# EAGLE design schematics (EAGLE 9.4.2)
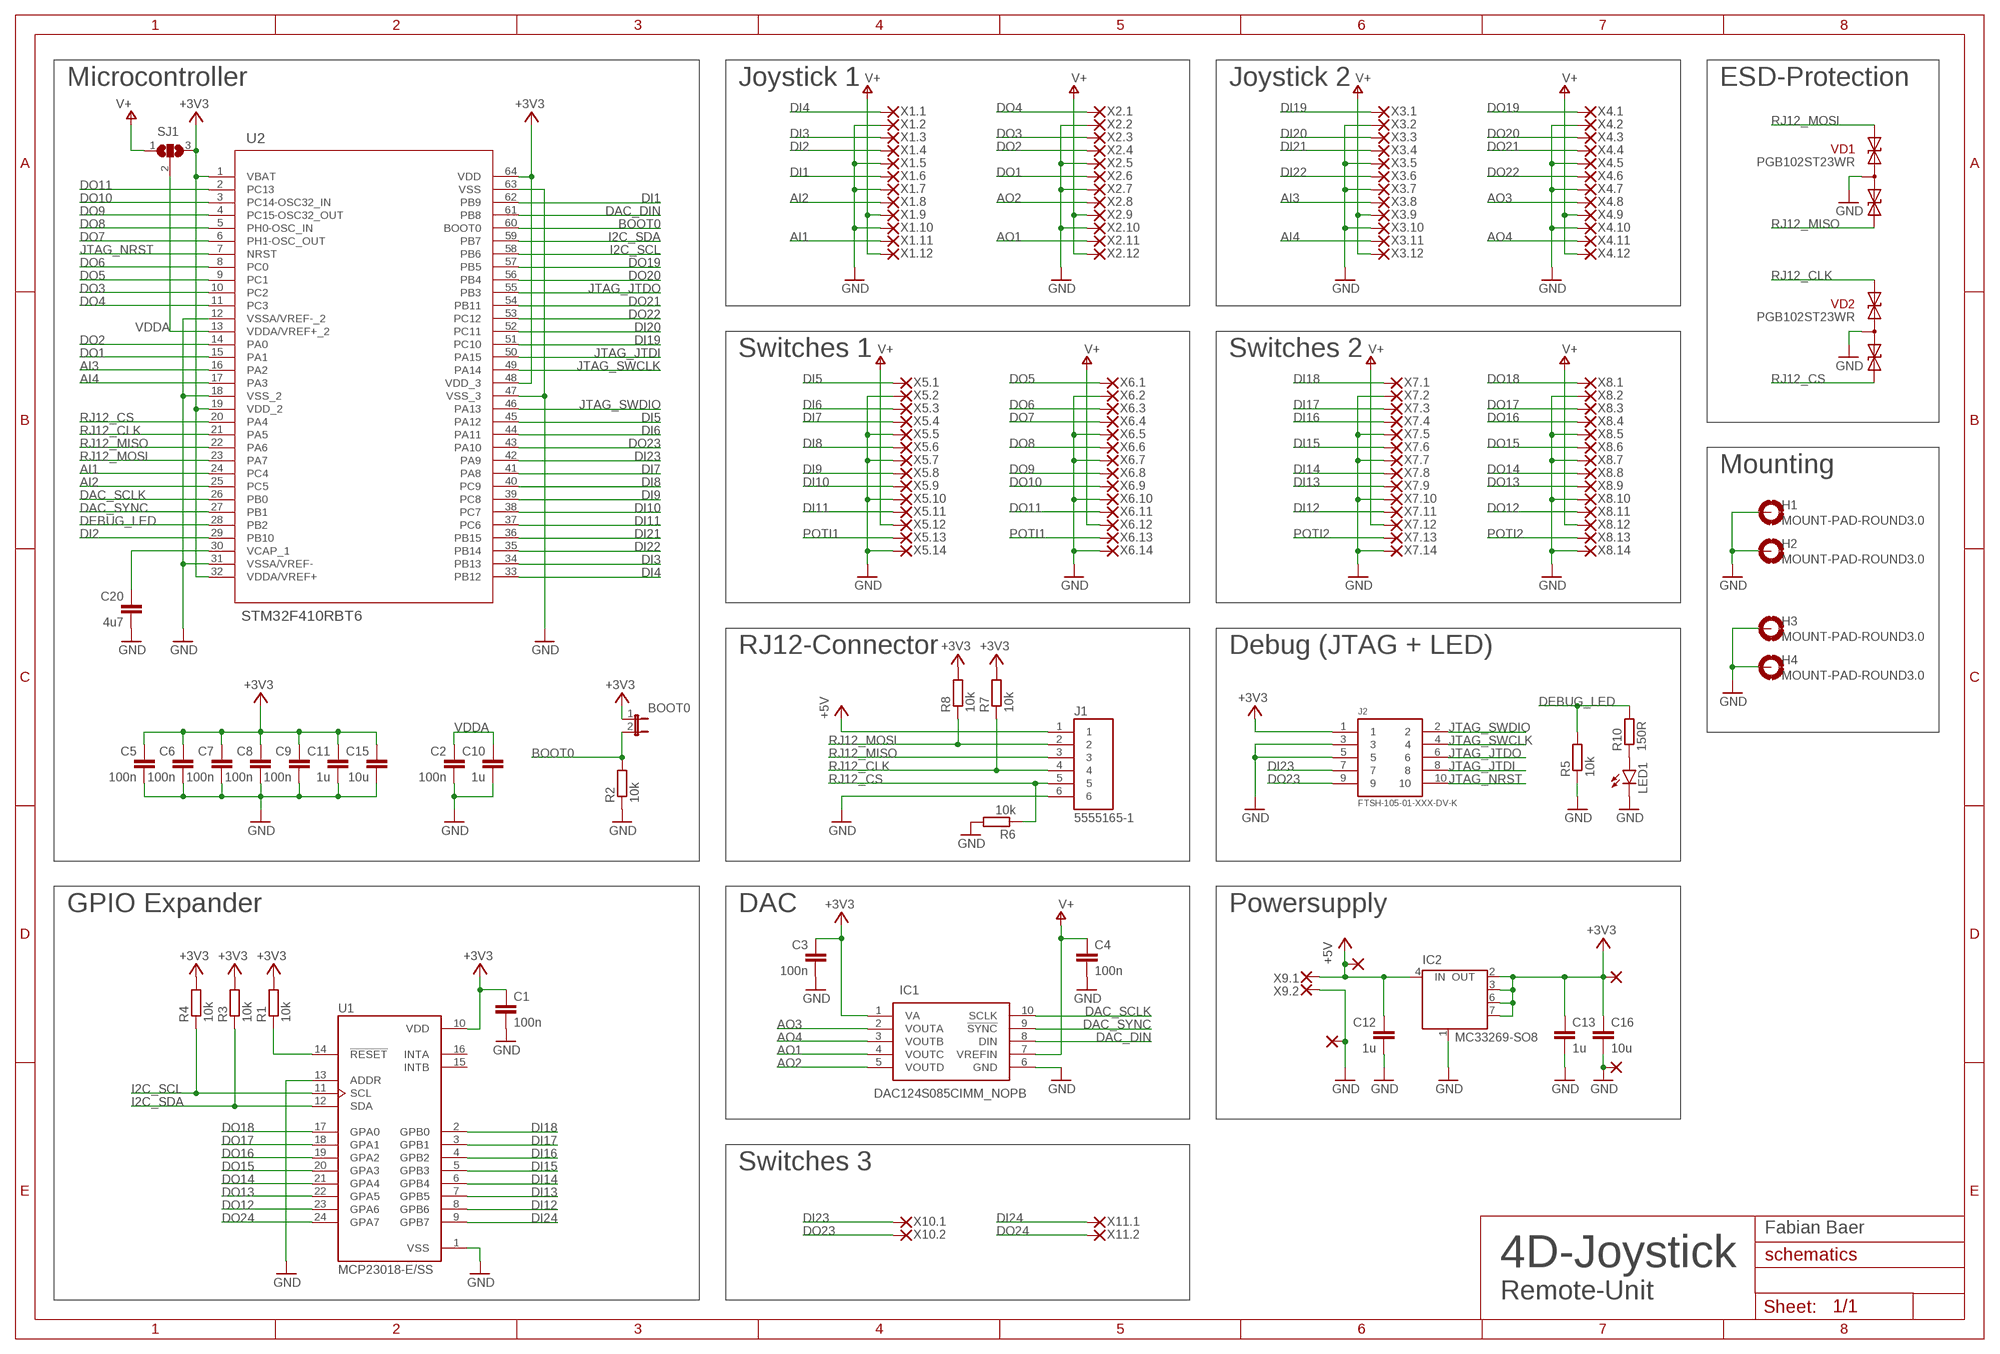
[diagram p0: schematic, sheet 1]

## Parts
BOOT0  JP1E  [JP1]
C1  100n  C-EUC0603  [C0603]
C2  100n  C-EUC0603  [C0603]
C3  100n  C-EUC0603  [C0603]
C4  100n  C-EUC0603  [C0603]
C5  100n  C-EUC0603  [C0603]
C6  100n  C-EUC0603  [C0603]
C7  100n  C-EUC0603  [C0603]
C8  100n  C-EUC0603  [C0603]
C9  100n  C-EUC0603  [C0603]
C10  1u  C-EUC0603  [C0603]
C11  1u  C-EUC0603  [C0603]
C12  1u  C-EUC0603  [C0603]
C13  1u  C-EUC0603  [C0603]
C15  10u  C-EUC0603  [C0603]
C16  10u  C-EUC0603  [C0603]
C20  4u7  C-EUC0603  [C0603]
H1  MOUNT-PAD-ROUND3.0  [3,0-PAD]
H2  MOUNT-PAD-ROUND3.0  [3,0-PAD]
H3  MOUNT-PAD-ROUND3.0  [3,0-PAD]
H4  MOUNT-PAD-ROUND3.0  [3,0-PAD]
IC1  DAC124S085CIMM_NOPB  [SOP50P490X110-10N]
IC2  MC33269-SO8  [SO08]
J1  5555165-1  [TE_5555165-1]
J2  FTSH-105-01-XXX-DV-K  [FTSH-105-01-XXX-DV-K]
LED1  LEDSML0603  [SML0603]
R1  10k  R-EU_R0603  [R0603]
R2  10k  R-EU_R0603  [R0603]
R3  10k  R-EU_R0603  [R0603]
R4  10k  R-EU_R0603  [R0603]
R5  10k  R-EU_R0603  [R0603]
R6  10k  R-EU_R0603  [R0603]
R7  10k  R-EU_R0603  [R0603]
R8  10k  R-EU_R0603  [R0603]
R10  150R  R-EU_R0603  [R0603]
SJ1  SJ2W  [SJ_2]
U1  MCP23018-E/SS  [SOP65P780X200-24N]
U2  STM32F410RBT6  [LQFP64-10X10MM]
VD1  PGB102ST23WR  [SOT23]
VD2  PGB102ST23WR  [SOT23]
X1.1  WIREPAD1,6/0,9  [1,6/0,9]
X1.2  WIREPAD1,6/0,9  [1,6/0,9]
X1.3  WIREPAD1,6/0,9  [1,6/0,9]
X1.4  WIREPAD1,6/0,9  [1,6/0,9]
X1.5  WIREPAD1,6/0,9  [1,6/0,9]
X1.6  WIREPAD1,6/0,9  [1,6/0,9]
X1.7  WIREPAD1,6/0,9  [1,6/0,9]
X1.8  WIREPAD1,6/0,9  [1,6/0,9]
X1.9  WIREPAD1,6/0,9  [1,6/0,9]
X1.10  WIREPAD1,6/0,9  [1,6/0,9]
X1.11  WIREPAD1,6/0,9  [1,6/0,9]
X1.12  WIREPAD1,6/0,9  [1,6/0,9]
X2.1  WIREPAD1,6/0,9  [1,6/0,9]
X2.2  WIREPAD1,6/0,9  [1,6/0,9]
X2.3  WIREPAD1,6/0,9  [1,6/0,9]
X2.4  WIREPAD1,6/0,9  [1,6/0,9]
X2.5  WIREPAD1,6/0,9  [1,6/0,9]
X2.6  WIREPAD1,6/0,9  [1,6/0,9]
X2.7  WIREPAD1,6/0,9  [1,6/0,9]
X2.8  WIREPAD1,6/0,9  [1,6/0,9]
X2.9  WIREPAD1,6/0,9  [1,6/0,9]
X2.10  WIREPAD1,6/0,9  [1,6/0,9]
X2.11  WIREPAD1,6/0,9  [1,6/0,9]
X2.12  WIREPAD1,6/0,9  [1,6/0,9]
X3.1  WIREPAD1,6/0,9  [1,6/0,9]
X3.2  WIREPAD1,6/0,9  [1,6/0,9]
X3.3  WIREPAD1,6/0,9  [1,6/0,9]
X3.4  WIREPAD1,6/0,9  [1,6/0,9]
X3.5  WIREPAD1,6/0,9  [1,6/0,9]
X3.6  WIREPAD1,6/0,9  [1,6/0,9]
X3.7  WIREPAD1,6/0,9  [1,6/0,9]
X3.8  WIREPAD1,6/0,9  [1,6/0,9]
X3.9  WIREPAD1,6/0,9  [1,6/0,9]
X3.10  WIREPAD1,6/0,9  [1,6/0,9]
X3.11  WIREPAD1,6/0,9  [1,6/0,9]
X3.12  WIREPAD1,6/0,9  [1,6/0,9]
X4.1  WIREPAD1,6/0,9  [1,6/0,9]
X4.2  WIREPAD1,6/0,9  [1,6/0,9]
X4.3  WIREPAD1,6/0,9  [1,6/0,9]
X4.4  WIREPAD1,6/0,9  [1,6/0,9]
X4.5  WIREPAD1,6/0,9  [1,6/0,9]
X4.6  WIREPAD1,6/0,9  [1,6/0,9]
X4.7  WIREPAD1,6/0,9  [1,6/0,9]
X4.8  WIREPAD1,6/0,9  [1,6/0,9]
X4.9  WIREPAD1,6/0,9  [1,6/0,9]
X4.10  WIREPAD1,6/0,9  [1,6/0,9]
X4.11  WIREPAD1,6/0,9  [1,6/0,9]
X4.12  WIREPAD1,6/0,9  [1,6/0,9]
X5.1  WIREPAD1,6/0,9  [1,6/0,9]
X5.2  WIREPAD1,6/0,9  [1,6/0,9]
X5.3  WIREPAD1,6/0,9  [1,6/0,9]
X5.4  WIREPAD1,6/0,9  [1,6/0,9]
X5.5  WIREPAD1,6/0,9  [1,6/0,9]
X5.6  WIREPAD1,6/0,9  [1,6/0,9]
X5.7  WIREPAD1,6/0,9  [1,6/0,9]
X5.8  WIREPAD1,6/0,9  [1,6/0,9]
X5.9  WIREPAD1,6/0,9  [1,6/0,9]
X5.10  WIREPAD1,6/0,9  [1,6/0,9]
X5.11  WIREPAD1,6/0,9  [1,6/0,9]
X5.12  WIREPAD1,6/0,9  [1,6/0,9]
X5.13  WIREPAD1,6/0,9  [1,6/0,9]
X5.14  WIREPAD1,6/0,9  [1,6/0,9]
X5.15  WIREPAD1,6/0,9  [1,6/0,9]
X5.16  WIREPAD1,6/0,9  [1,6/0,9]
X5.17  WIREPAD1,6/0,9  [1,6/0,9]
X5.18  WIREPAD1,6/0,9  [1,6/0,9]
X6.1  WIREPAD1,6/0,9  [1,6/0,9]
X6.2  WIREPAD1,6/0,9  [1,6/0,9]
X6.3  WIREPAD1,6/0,9  [1,6/0,9]
X6.4  WIREPAD1,6/0,9  [1,6/0,9]
X6.5  WIREPAD1,6/0,9  [1,6/0,9]
X6.6  WIREPAD1,6/0,9  [1,6/0,9]
X6.7  WIREPAD1,6/0,9  [1,6/0,9]
X6.8  WIREPAD1,6/0,9  [1,6/0,9]
X6.9  WIREPAD1,6/0,9  [1,6/0,9]
X6.10  WIREPAD1,6/0,9  [1,6/0,9]
X6.11  WIREPAD1,6/0,9  [1,6/0,9]
X6.12  WIREPAD1,6/0,9  [1,6/0,9]
X6.13  WIREPAD1,6/0,9  [1,6/0,9]
X6.14  WIREPAD1,6/0,9  [1,6/0,9]
X7.1  WIREPAD1,6/0,9  [1,6/0,9]
X7.2  WIREPAD1,6/0,9  [1,6/0,9]
X7.3  WIREPAD1,6/0,9  [1,6/0,9]
X7.4  WIREPAD1,6/0,9  [1,6/0,9]
X7.5  WIREPAD1,6/0,9  [1,6/0,9]
X7.6  WIREPAD1,6/0,9  [1,6/0,9]
X7.7  WIREPAD1,6/0,9  [1,6/0,9]
X7.8  WIREPAD1,6/0,9  [1,6/0,9]
X7.9  WIREPAD1,6/0,9  [1,6/0,9]
X7.10  WIREPAD1,6/0,9  [1,6/0,9]
X7.11  WIREPAD1,6/0,9  [1,6/0,9]
X7.12  WIREPAD1,6/0,9  [1,6/0,9]
X7.13  WIREPAD1,6/0,9  [1,6/0,9]
X7.14  WIREPAD1,6/0,9  [1,6/0,9]
X8.1  WIREPAD1,6/0,9  [1,6/0,9]
X8.2  WIREPAD1,6/0,9  [1,6/0,9]
X8.3  WIREPAD1,6/0,9  [1,6/0,9]
X8.4  WIREPAD1,6/0,9  [1,6/0,9]
X8.5  WIREPAD1,6/0,9  [1,6/0,9]
X8.6  WIREPAD1,6/0,9  [1,6/0,9]
X8.7  WIREPAD1,6/0,9  [1,6/0,9]
X8.8  WIREPAD1,6/0,9  [1,6/0,9]
X8.9  WIREPAD1,6/0,9  [1,6/0,9]
X8.10  WIREPAD1,6/0,9  [1,6/0,9]
X8.11  WIREPAD1,6/0,9  [1,6/0,9]
X8.12  WIREPAD1,6/0,9  [1,6/0,9]
X8.13  WIREPAD1,6/0,9  [1,6/0,9]
X8.14  WIREPAD1,6/0,9  [1,6/0,9]
X9.1  WIREPAD2,54/1,0  [2,54/1,0]
X9.2  WIREPAD2,54/1,0  [2,54/1,0]
X10.1  WIREPAD1,6/0,9  [1,6/0,9]
X10.2  WIREPAD1,6/0,9  [1,6/0,9]
X11.1  WIREPAD1,6/0,9  [1,6/0,9]
X11.2  WIREPAD1,6/0,9  [1,6/0,9]

## Nets
+3V3: BOOT0.1 C1.1 C3.1 C5.1 C6.1 C7.1 C8.1 C9.1 C11.1 C13.1 C15.1 C16.1 IC1.1(VA) IC2.2(OUT) IC2.3(OUT) IC2.6(OUT) IC2.7(OUT) J2.1 R1.2 R3.2 R4.2 R7.2 R8.2 SJ1.3 U1.10(VDD) U2.1(VBAT) U2.19(VDD_2) U2.32(VDDA/VREF+) U2.48(VDD_3) U2.64(VDD) X5.15.1(P)
+5V: C12.1 IC2.4(IN) J1.1 X5.17.1(P) X9.1.1(P)
AI1: U2.24(PC4) X1.11.1(P)
AI2: U2.25(PC5) X1.8.1(P)
AI3: U2.16(PA2) X3.8.1(P)
AI4: U2.17(PA3) X3.11.1(P)
AO1: IC1.4(VOUTC) X2.11.1(P)
AO2: IC1.5(VOUTD) X2.8.1(P)
AO3: IC1.2(VOUTA) X4.8.1(P)
AO4: IC1.3(VOUTB) X4.11.1(P)
BOOT0: BOOT0.2 R2.2 U2.60(BOOT0)
DAC_DIN: IC1.8(DIN) U2.61(PB8)
DAC_SCLK: IC1.10(SCLK) U2.26(PB0)
DAC_SYNC: IC1.9(!SYNC) U2.27(PB1)
DEBUG_LED: R5.2 R10.2 U2.28(PB2)
DI1: U2.62(PB9) X1.6.1(P)
DI2: U2.29(PB10) X1.4.1(P)
DI3: U2.34(PB13) X1.3.1(P)
DI4: U2.33(PB12) X1.1.1(P)
DI5: U2.45(PA12) X5.1.1(P)
DI6: U2.44(PA11) X5.3.1(P)
DI7: U2.41(PA8) X5.4.1(P)
DI8: U2.40(PC9) X5.6.1(P)
DI9: U2.39(PC8) X5.8.1(P)
DI10: U2.38(PC7) X5.9.1(P)
DI11: U2.37(PC6) X5.11.1(P)
DI12: U1.8(GPB6) X7.11.1(P)
DI13: U1.7(GPB5) X7.9.1(P)
DI14: U1.6(GPB4) X7.8.1(P)
DI15: U1.5(GPB3) X7.6.1(P)
DI16: U1.4(GPB2) X7.4.1(P)
DI17: U1.3(GPB1) X7.3.1(P)
DI18: U1.2(GPB0) X7.1.1(P)
DI19: U2.51(PC10) X3.1.1(P)
DI20: U2.52(PC11) X3.3.1(P)
DI21: U2.36(PB15) X3.4.1(P)
DI22: U2.35(PB14) X3.6.1(P)
DI23: J2.7 U2.42(PA9) X10.1.1(P)
DI24: U1.9(GPB7) X11.1.1(P)
DO1: U2.15(PA1) X2.6.1(P)
DO2: U2.14(PA0) X2.4.1(P)
DO3: U2.10(PC2) X2.3.1(P)
DO4: U2.11(PC3) X2.1.1(P)
DO5: U2.9(PC1) X6.1.1(P)
DO6: U2.8(PC0) X6.3.1(P)
DO7: U2.6(PH1-OSC_OUT) X6.4.1(P)
DO8: U2.5(PH0-OSC_IN) X6.6.1(P)
DO9: U2.4(PC15-OSC32_OUT) X6.8.1(P)
DO10: U2.3(PC14-OSC32_IN) X6.9.1(P)
DO11: U2.2(PC13) X6.11.1(P)
DO12: U1.23(GPA6) X8.11.1(P)
DO13: U1.22(GPA5) X8.9.1(P)
DO14: U1.21(GPA4) X8.8.1(P)
DO15: U1.20(GPA3) X8.6.1(P)
DO16: U1.19(GPA2) X8.4.1(P)
DO17: U1.18(GPA1) X8.3.1(P)
DO18: U1.17(GPA0) X8.1.1(P)
DO19: U2.57(PB5) X4.1.1(P)
DO20: U2.56(PB4) X4.3.1(P)
DO21: U2.54(PB11) X4.4.1(P)
DO22: U2.53(PC12) X4.6.1(P)
DO23: J2.9 U2.43(PA10) X10.2.1(P)
DO24: U1.24(GPA7) X11.2.1(P)
GND: C1.2 C2.2 C3.2 C4.2 C5.2 C6.2 C7.2 C8.2 C9.2 C10.2 C11.2 C12.2 C13.2 C15.2 C16.2 C20.2 H1.B3,0(MOUNT) H2.B3,0(MOUNT) H3.B3,0(MOUNT) H4.B3,0(MOUNT) IC1.6(GND) IC2.1(GND/ADJ) J1.6 J2.3 J2.5 LED1.C R2.1 R5.1 R6.2 U1.1(VSS) U1.13(ADDR) U2.12(VSSA/VREF-_2) U2.18(VSS_2) U2.31(VSSA/VREF-) U2.47(VSS_3) U2.63(VSS) VD1.3(C) VD2.3(C) X1.2.1(P) X1.5.1(P) X1.7.1(P) X1.10.1(P) X2.2.1(P) X2.5.1(P) X2.7.1(P) X2.10.1(P) X3.2.1(P) X3.5.1(P) X3.7.1(P) X3.10.1(P) X4.2.1(P) X4.5.1(P) X4.7.1(P) X4.10.1(P) X5.2.1(P) X5.5.1(P) X5.7.1(P) X5.10.1(P) X5.14.1(P) X5.16.1(P) X5.18.1(P) X6.2.1(P) X6.5.1(P) X6.7.1(P) X6.10.1(P) X6.14.1(P) X7.2.1(P) X7.5.1(P) X7.7.1(P) X7.10.1(P) X7.14.1(P) X8.2.1(P) X8.5.1(P) X8.7.1(P) X8.10.1(P) X8.14.1(P) X9.2.1(P)
I2C_SCL: R4.1 U1.11(SCL) U2.58(PB6)
I2C_SDA: R3.1 U1.12(SDA) U2.59(PB7)
JTAG_JTDI: J2.8 U2.50(PA15)
JTAG_JTDO: J2.6 U2.55(PB3)
JTAG_NRST: J2.10 U2.7(NRST)
JTAG_SWCLK: J2.4 U2.49(PA14)
JTAG_SWDIO: J2.2 U2.46(PA13)
N$1: R1.1 U1.14(!RESET)
N$2: C20.1 U2.30(VCAP_1)
N$5: LED1.A R10.1
POTI1: X5.13.1(P) X6.13.1(P)
POTI2: X7.13.1(P) X8.13.1(P)
RJ12_CLK: J1.4 R7.1 U2.21(PA5) VD2.2(A1)
RJ12_CS: J1.5 R6.1 U2.20(PA4) VD2.1(A)
RJ12_MISO: J1.3 U2.22(PA6) VD1.1(A)
RJ12_MOSI: J1.2 R8.1 U2.23(PA7) VD1.2(A1)
V+: C4.1 IC1.7(VREFIN) SJ1.1 X1.9.1(P) X1.12.1(P) X2.9.1(P) X2.12.1(P) X3.9.1(P) X3.12.1(P) X4.9.1(P) X4.12.1(P) X5.12.1(P) X6.12.1(P) X7.12.1(P) X8.12.1(P)
VDDA: C2.1 C10.1 SJ1.2 U2.13(VDDA/VREF+_2)
Unconnected: U1.15(INTB) U1.16(INTA)

## Notes on the sheet
- Microcontroller | Joystick 1 | Joystick 2 | ESD-Protection
- Switches 1 | Switches 2
- Mounting
- RJ12-Connector | Debug (JTAG + LED)
- GPIO Expander | DAC | Powersupply
- Switches 3
- Fabian Baer
- 4D-Joystick
- Remote-Unit

## Library data of the parts
BOOT0 = jumper:JP1E: JUMPER
C1-C13 C15 C16 C20 = rcl:C-EU: CAPACITOR, European symbol; SPICEPREFIX: C
H1-H4 = holes:MOUNT-PAD-ROUND: MOUNTING PAD, round
IC1 = DAC124S085CIMM_NOPB:DAC124S085CIMM_NOPB: 12-Bit Micro Power QUAD Digital-to-Analog Converter with Rail-to-Rail Output Source: Datasheet <http://www.ti.com/lit/gpn/dac124s085>; DESCRIPTION: 12-Bit Micro Power QUAD Digital-to-Analog Converter with Rail-to-Rail Output; HEIGHT: 1.1mm; MANUFACTURER_NAME: Texas Instruments; MANUFACTURER_PART_NUMBER: DAC124S085CIMM/NOPB; MOUSER_PART_NUMBER: 926-DAC124S085CIMMNO; MOUSER_PRICE-STOCK: https://www.mouser.com/Search/Refine.aspx?Keyword=926-DAC124S085CIMMNO; RS_PART_NUMBER: 6512026P; RS_PRICE-STOCK: http://uk.rs-online.com/web/p/products/6512026P
IC2 = linear:MC33269-SO8: Adjustable Output Low Dropout Voltage Regulator 800 mA Source: http://www.onsemi.com/pub/Collateral/MC33269-D.PDF
J1 = 5555165-1:5555165-1: CONN MOD JACK 6P6C R/A UNSHLD; AVAILABILITY: Unavailable; CENTERLINE_PITCH: 1.02 mm[.04 in]; COMMENT: 5555165-1; DESCRIPTION: Conn RJ-25 F 6 POS 2.54mm Solder RA Thru-Hole 6 Terminal 1 Port Cat 3 Box/Package/Tray; EU_ROHS_COMPLIANCE: Compliant; MF: TE Connectivity; MP: 5555165-1; NUMBER_OF_POSITIONS: 6; PACKAGE: None; PRICE: None; TE_PURCHASE_URL: https://www.te.com/usa-en/product-5555165-1.html?te_bu=Cor&te_type=disp&te_campaign=seda_glo_cor-seda-global-disp-prtnr-fy19-seda-model-bom-cta_sma-317_1&elqCampaignId=32493
J2 = FTSH-105-01-XXX-DV-K:FTSH-105-01-XXX-DV-K: 0.05"x0.05" DOUBLE ROW SMT STRIP ASSEMBLY. MANUFACTURER:SAMTEC.
LED1 = led:LED: LED OSRAM: - CHIPLED LG R971, LG N971, LY N971, LG Q971, LY Q971, LO R971, LY R971 LH N974, LH R974 LS Q976, LO Q976, LY Q976 LO Q996 - Hyper CHIPLED LW Q18S LB Q993, LB Q99A, LB R99A - SideLED LS A670, LO A670, LY A670, LG A670, LP A670 LB A673, LV A673, LT A673, LW A673 LH A674 LY A675 LS A676, LA A676, LO A676, LY A676, LW A676 LS A679, LY A679, LG A679 - Hyper Micro SIDELED® LS Y876, LA Y876, LO Y876, LY Y876 LT Y87S - SmartLED LW L88C, LW L88S LB L89C, LB L89S, LG L890 LS L89K, LO L89K, LY L89K LS L896, LA L896, LO L896, LY L896 - TOPLED LS T670, LO T670, LY T670, LG T670, LP T670 LSG T670, LSP T670, LSY T670, LOP T670, LYG T670 LG T671, LOG T671, LSG T671 LB T673, LV T673, LT T673, LW T673 LH T674 LS T676, LA T676, LO T676, LY T676, LB T676, LH T676, LSB T676, LW T676 LB T67C, LV T67C, LT T67C, LS T67K, LO T67K, LY T67K, LW E67C LS E67B, LA E67B, LO E67B, LY E67B, LB E67C, LV E67C, LT E67C LW T67C LS T679, LY T679, LG T679 LS T770, LO T770, LY T770, LG T770, LP T770 LB T773, LV T773, LT T773, LW T773 LH T774 LS E675, LA E675, LY E675, LS T675 LS T776, LA T776, LO T776, LY T776, LB T776 LHGB T686 LT T68C, LB T68C - Hyper Mini TOPLED® LB M676 - Mini TOPLED Santana® LG M470 LS M47K, LO M47K, LY M47K Source: http://www.osram.convergy.de LUXEON: - LUMILED® LXK2-PW12-R00, LXK2-PW12-S00, LXK2-PW14-U00, LXK2-PW14-V00 LXK2-PM12-R00, LXK2-PM12-S00, LXK2-PM14-U00 LXK2-PE12-Q00, LXK2-PE12-R00, LXK2-PE12-S00, LXK2-PE14-T00, LXK2-PE14-U00 LXK2-PB12-K00, LXK2-PB12-L00, LXK2-PB12-M00, LXK2-PB14-N00, LXK2-PB14-P00, LXK2-PB14-Q00 LXK2-PR12-L00, LXK2-PR12-M00, LXK2-PR14-Q00, LXK2-PR14-R00 LXK2-PD12-Q00, LXK2-PD12-R00, LXK2-PD12-S00 LXK2-PH12-R00, LXK2-PH12-S00 LXK2-PL12-P00, LXK2-PL12-Q00, LXK2-PL12-R00 Source: www.luxeon.com KINGBRIGHT: KA-3528ASYC Source: www.kingbright.com
R1-R8 R10 = rcl:R-EU_: RESISTOR, European symbol; SPICEPREFIX: R
SJ1 = jumper:SJ2W: SMD solder JUMPER
U1 = MCP23018-E_SS:MCP23018-E/SS: IC: expander; 16bit I/O port; I2C; SSOP24; 1.8÷5.5VDC; AVAILABILITY: Unavailable; DESCRIPTION: IC: expander; 16bit I/O port; I2C; SSOP24; 1.8÷5.5VDC; MF: Microchip; MP: MCP23018-E/SS; PACKAGE: SSOP-24 Microchip; PRICE: None
U2 = stm32f10:STM32F410RBT6; MANUFACTURER_PART_NUMBER: stm32f410r3; VENDOR: STMicroelectronics
VD1 VD2 = diodes-zener:PGB102ST23WR; MOUSER: 576-PGB102ST23WR
X1.1-X1.12 X2.1-X2.12 X3.1-X3.12 X4.1-X4.12 X5.1-X5.18 X6.1-X6.14 X7.1-X7.14 X8.1-X8.14 X9.1 X9.2 X10.1 X10.2 X11.1 X11.2 = wirepad:WIREPAD: Wire PAD connect wire on PCB

## Board
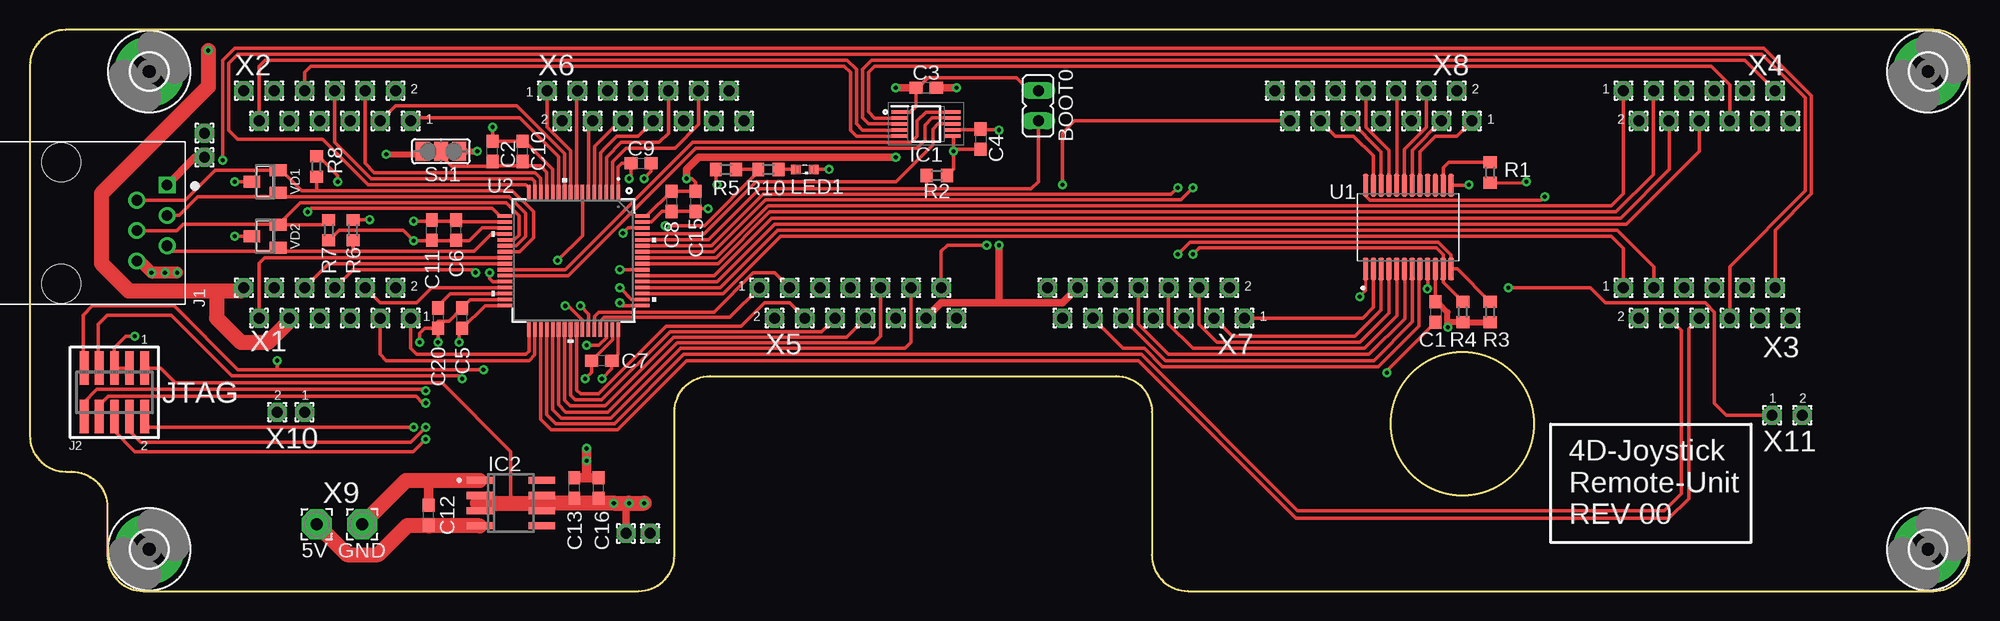
[diagram p1: board, top side]
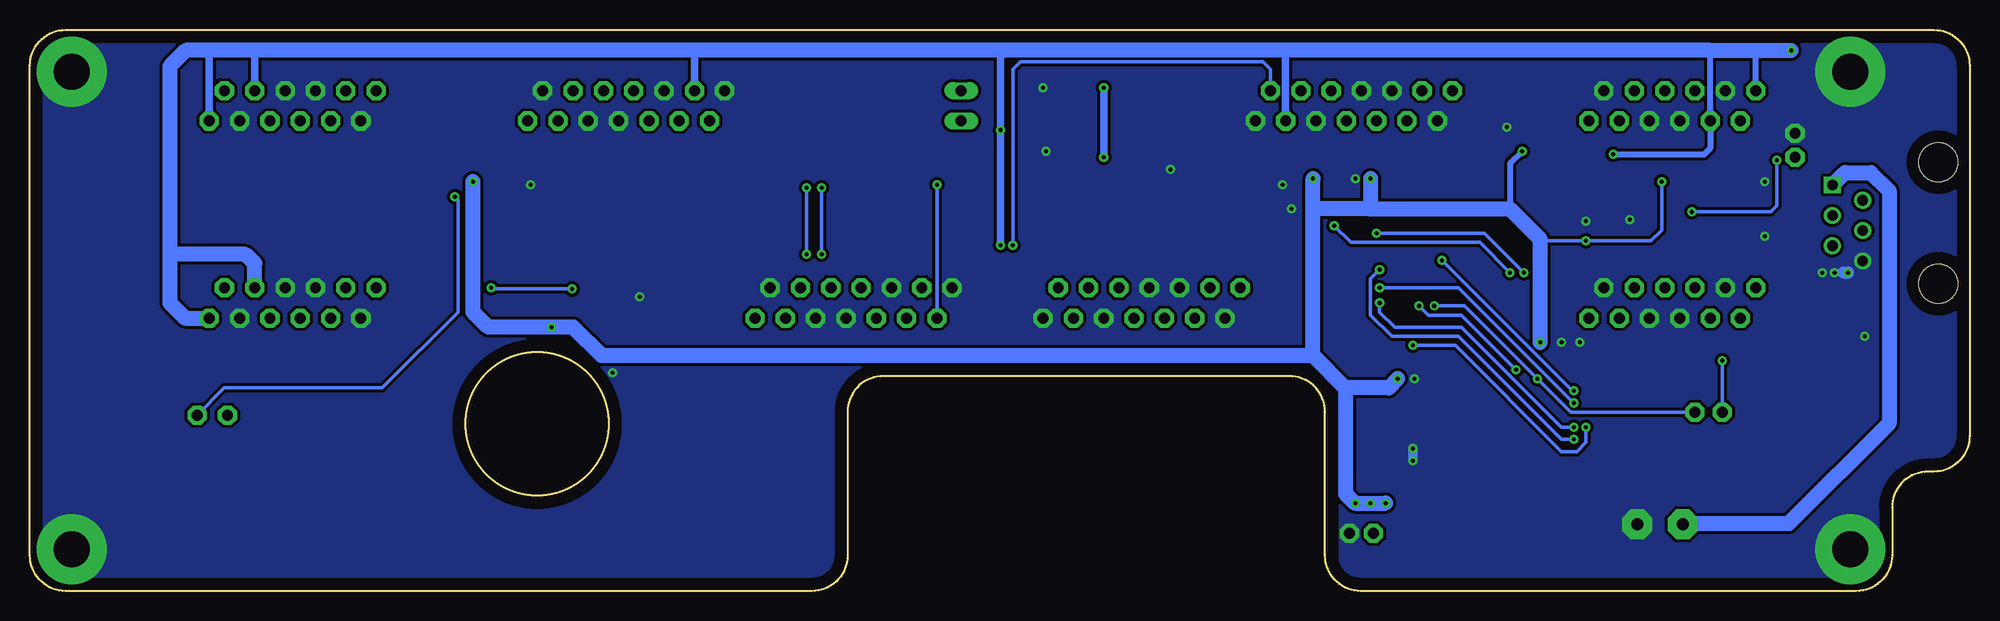
[diagram p2: board, bottom side, seen from below]

Size 162.5 x 47 mm. Coordinates in mm from the lower left corner, seen from the top.
Outline: 6.5,3 arc90 9.5,0 51,0 arc90 54,3 54,15 arc-90 57,18 91,18 arc-90 94,15 94,3 arc90 97,0 159.5,0 arc90 162.5,3 162.5,44 arc90 159.5,47 3,47 arc90 0,44 0,13 arc90 3,10 3.5,10 arc-90 6.5,7 6.5,3
Outline: circle at 120,14 radius 6
Copper layers (1*16): Top 0.035mm / dielectric 1.5mm / Bottom 0.035mm
Design rules "default *": minimum track width 6mil, minimum drill 0.35mm, track to track 6mil, track to pad 6mil, pad to pad 6mil, via to via 6mil, smd to smd 6mil, copper to edge 40mil, drill to drill 6mil, minimum pad ring 10mil, minimum via ring 8mil, stop-mask expansion 2mil, vias tented up to drill 0mil, thermal gap 10mil

### Footprints (pad centres in the part's own frame; a part is rotated, then mirrored left to right if it is on the bottom)
JP1 = drill 0.914 long: 1 0,-1.27; 2 0,1.27
C0603 = smd 1.1 x 1: 1 -0.85,0; 2 0.85,0
3,0-PAD = drill 3 pad 5.842: B3,0 0,0
SOP50P490X110-10N = smd 1.4 x 0.3: 1 -2.2,1; 2 -2.2,0.5; 3 -2.2,0; 4 -2.2,-0.5; 5 -2.2,-1; 6 2.2,-1; 7 2.2,-0.5; 8 2.2,0; 9 2.2,0.5; 10 2.2,1
SO08 = smd 0.6 x 2.2: 1 -1.905,-2.6; 2 -0.635,-2.6; 3 0.635,-2.6; 4 1.905,-2.6; 5 1.905,2.6; 6 0.635,2.6; 7 -0.635,2.6; 8 -1.905,2.6
TE_5555165-1 = drill 0.89 square: 1 0,0 | drill 0.89: 2 1.27,-2.54; 3 2.54,0; 4 3.81,-2.54; 5 5.08,0; 6 6.35,-2.54 | hole 3.25: -1.91,-8.89; 8.25,-8.89
FTSH-105-01-XXX-DV-K = smd 0.737 x 2.794: 1 -2.54,-2.032; 2 -2.54,2.032; 3 -1.27,-2.032; 4 -1.27,2.032; 5 0,-2.032; 6 0,2.032; 7 1.27,-2.032; 8 1.27,2.032; 9 2.54,-2.032; 10 2.54,2.032
SML0603 = smd 0.8 x 0.8: A 0.75,0; C -0.75,0
R0603 = smd 1 x 1.1: 1 -0.85,0; 2 0.85,0
SJ_2 = smd 1.168 x 1.6: 1 -1.524,0; 2 0,0; 3 1.524,0
SOP65P780X200-24N = smd 1.9 x 0.48: 1 -3.505,3.575; 2 -3.505,2.925; 3 -3.505,2.275; 4 -3.505,1.625; 5 -3.505,0.975; 6 -3.505,0.325; 7 -3.505,-0.325; 8 -3.505,-0.975; 9 -3.505,-1.625; 10 -3.505,-2.275; 11 -3.505,-2.925; 12 -3.505,-3.575; 13 3.505,-3.575; 14 3.505,-2.925; 15 3.505,-2.275; 16 3.505,-1.625; 17 3.505,-0.975; 18 3.505,-0.325; 19 3.505,0.325; 20 3.505,0.975; 21 3.505,1.625; 22 3.505,2.275; 23 3.505,2.925; 24 3.505,3.575
LQFP64-10X10MM = smd 1.194 x 0.305: 1 -5.75,3.75; 2 -5.75,3.25; 3 -5.75,2.75; 4 -5.75,2.25; 5 -5.75,1.75; 6 -5.75,1.25; 7 -5.75,0.75; 8 -5.75,0.25; 9 -5.75,-0.25; 10 -5.75,-0.75; 11 -5.75,-1.25; 12 -5.75,-1.75; 13 -5.75,-2.25; 14 -5.75,-2.75; 15 -5.75,-3.25; 16 -5.75,-3.75; 33 5.75,-3.75; 34 5.75,-3.25; 35 5.75,-2.75; 36 5.75,-2.25; 37 5.75,-1.75; 38 5.75,-1.25; 39 5.75,-0.75; 40 5.75,-0.25; 41 5.75,0.25; 42 5.75,0.75; 43 5.75,1.25; 44 5.75,1.75; 45 5.75,2.25; 46 5.75,2.75; 47 5.75,3.25; 48 5.75,3.75 | smd 0.305 x 1.194: 17 -3.75,-5.75; 18 -3.25,-5.75; 19 -2.75,-5.75; 20 -2.25,-5.75; 21 -1.75,-5.75; 22 -1.25,-5.75; 23 -0.75,-5.75; 24 -0.25,-5.75; 25 0.25,-5.75; 26 0.75,-5.75; 27 1.25,-5.75; 28 1.75,-5.75; 29 2.25,-5.75; 30 2.75,-5.75; 31 3.25,-5.75; 32 3.75,-5.75; 49 3.75,5.75; 50 3.25,5.75; 51 2.75,5.75; 52 2.25,5.75; 53 1.75,5.75; 54 1.25,5.75; 55 0.75,5.75; 56 0.25,5.75; 57 -0.25,5.75; 58 -0.75,5.75; 59 -1.25,5.75; 60 -1.75,5.75; 61 -2.25,5.75; 62 -2.75,5.75; 63 -3.25,5.75; 64 -3.75,5.75
SOT23 = smd 1 x 1.4: 1 -0.95,-1.1; 2 0.95,-1.1; 3 0,1.1
1,6/0,9 = drill 0.914 pad 1.6 octagon: 1 0,0
2,54/1,0 = drill 1.016 pad 2.54 octagon: 1 0,0

### Placement (x,y rotation side)
BOOT0  84.48,40.64 180 top
C1  117.75,23.37 270 top
C2  38.76,36.83 90 top
C3  75.08,42.16 0 top
C4  79.65,37.85 270 top
C5  36.22,22.86 90 top
C6  35.71,30.23 90 top
C7  47.9,19.3 180 top
C8  53.74,32.64 270 top
C9  51.2,35.81 0 top
C10  41.3,36.83 90 top
C11  33.68,30.23 90 top
C12  33.42,6.35 90 top
C13  45.62,8.64 90 top
C15  55.78,32.64 270 top
C16  47.65,8.64 90 top
C20  34.19,22.86 270 top
H1  10,3.5 0 top
H2  159,3.5 0 top
H3  10,43.5 0 top
H4  159,43.5 0 top
IC1  75.08,39.12 0 top
IC2  40.28,7.37 270 top
J1  11.5,34 270 top
J2  7.08,16.64 180 top
LED1  64.92,35.31 180 top
R1  122.32,35.05 270 top
R2  75.97,34.8 180 top
R3  122.32,23.37 270 top
R4  120.04,23.37 270 top
R5  58.32,35.31 0 top
R6  27.07,30.23 90 top
R7  25.04,30.23 270 top
R8  24.03,35.56 90 top
R10  61.87,35.31 180 top
SJ1  34.44,36.83 0 top
U1  115.47,30.48 90 top
U2  45.55,27.66 270 top
VD1  19.71,34.29 90 top
VD2  19.71,29.72 90 top
X1.1  31.9,22.86 180 top
X1.2  30.63,25.4 180 top
X1.3  29.36,22.86 180 top
X1.4  28.09,25.4 180 top
X1.5  26.82,22.86 180 top
X1.6  25.55,25.4 180 top
X1.7  24.28,22.86 180 top
X1.8  23.01,25.4 180 top
X1.9  21.74,22.86 180 top
X1.10  20.47,25.4 180 top
X1.11  19.2,22.86 180 top
X1.12  17.93,25.4 180 top
X2.1  31.9,39.37 180 top
X2.2  30.63,41.91 180 top
X2.3  29.36,39.37 180 top
X2.4  28.09,41.91 180 top
X2.5  26.82,39.37 180 top
X2.6  25.55,41.91 180 top
X2.7  24.28,39.37 180 top
X2.8  23.01,41.91 180 top
X2.9  21.74,39.37 180 top
X2.10  20.47,41.91 180 top
X2.11  19.2,39.37 180 top
X2.12  17.93,41.91 180 top
X3.1  133.5,25.4 0 top
X3.2  134.77,22.86 0 top
X3.3  136.04,25.4 0 top
X3.4  137.31,22.86 0 top
X3.5  138.58,25.4 0 top
X3.6  139.85,22.86 0 top
X3.7  141.12,25.4 0 top
X3.8  142.39,22.86 0 top
X3.9  143.66,25.4 0 top
X3.10  144.93,22.86 0 top
X3.11  146.2,25.4 0 top
X3.12  147.47,22.86 0 top
X4.1  133.5,41.91 0 top
X4.2  134.77,39.37 0 top
X4.3  136.04,41.91 0 top
X4.4  137.31,39.37 0 top
X4.5  138.58,41.91 0 top
X4.6  139.85,39.37 0 top
X4.7  141.12,41.91 0 top
X4.8  142.39,39.37 0 top
X4.9  143.66,41.91 0 top
X4.10  144.93,39.37 0 top
X4.11  146.2,41.91 0 top
X4.12  147.47,39.37 0 top
X5.1  61.11,25.4 0 top
X5.2  62.38,22.86 0 top
X5.3  63.65,25.4 0 top
X5.4  64.92,22.86 0 top
X5.5  66.19,25.4 0 top
X5.6  67.46,22.86 0 top
X5.7  68.73,25.4 0 top
X5.8  70,22.86 0 top
X5.9  71.27,25.4 0 top
X5.10  72.54,22.86 0 top
X5.11  73.81,25.4 0 top
X5.12  75.08,22.86 0 top
X5.13  76.35,25.4 0 top
X5.14  77.62,22.86 0 top
X5.15  49.93,4.83 0 top
X5.16  51.97,4.83 0 top
X5.17  14.63,36.32 0 top
X5.18  14.63,38.35 0 top
X6.1  43.33,41.91 0 top
X6.2  44.6,39.37 0 top
X6.3  45.87,41.91 0 top
X6.4  47.14,39.37 0 top
X6.5  48.41,41.91 0 top
X6.6  49.68,39.37 0 top
X6.7  50.95,41.91 0 top
X6.8  52.22,39.37 0 top
X6.9  53.49,41.91 0 top
X6.10  54.76,39.37 0 top
X6.11  56.03,41.91 0 top
X6.12  57.3,39.37 0 top
X6.13  58.57,41.91 0 top
X6.14  59.84,39.37 0 top
X7.1  101.75,22.86 180 top
X7.2  100.48,25.4 180 top
X7.3  99.21,22.86 180 top
X7.4  97.94,25.4 180 top
X7.5  96.67,22.86 180 top
X7.6  95.4,25.4 180 top
X7.7  94.13,22.86 180 top
X7.8  92.86,25.4 180 top
X7.9  91.59,22.86 180 top
X7.10  90.32,25.4 180 top
X7.11  89.05,22.86 180 top
X7.12  87.78,25.4 180 top
X7.13  86.51,22.86 180 top
X7.14  85.24,25.4 180 top
X8.1  120.8,39.37 180 top
X8.2  119.53,41.91 180 top
X8.3  118.26,39.37 180 top
X8.4  116.99,41.91 180 top
X8.5  115.72,39.37 180 top
X8.6  114.45,41.91 180 top
X8.7  113.18,39.37 180 top
X8.8  111.91,41.91 180 top
X8.9  110.64,39.37 180 top
X8.10  109.37,41.91 180 top
X8.11  108.1,39.37 180 top
X8.12  106.83,41.91 180 top
X8.13  105.56,39.37 180 top
X8.14  104.29,41.91 180 top
X9.1  24.03,5.59 0 top
X9.2  27.84,5.59 0 top
X10.1  23.01,14.99 0 top
X10.2  20.72,14.99 0 top
X11.1  145.95,14.73 0 top
X11.2  148.49,14.73 0 top

### Tracks (layer width: path | path; a pad name or v marks a point on that pad's centre or on a via)
+3V3  (via drill 0.35)
  Top 0.254: R1.2 125.28,34.2 v125.37,34.29
  Top 0.305: U1.10 C1.1 | J2.1 10.94,18.67 12.17,17.45 34.52,17.45 40.28,11.68 40.28,7.37 | U2.48 49.3,19.85 C7.1 48.75,18.61 v47.92,17.78 | U2.64 51.67,31.41 C8.1 C15.1 55.78,34.25 55.48,34.54 v55.01,34.54 | U2.1 49.3,35.52 49.59,35.81 C9.1 50.35,34.71 v50.19,34.54 | v35.96,20.83 35.96,21.76 C5.1 38.12,23.91 U2.32 | U2.19 37.89,30.41 36.81,29.34 35.67,29.34 | IC1.1 73.79,40.12 74.23,40.55 C3.1 74.45,42.16 75.25,42.97 82.66,42.97 83.72,41.91 BOOT0.1 | v48.92,7.37 48.92,7.28 48.66,7.28 | 35.67,29.34 C6.1 | 33.68,29.34 v32.15,29.34 31.27,30.23 25.89,30.23 R7.2 | 33.68,29.34 35.67,29.34 | C11.1 33.68,29.34 | IC2.7 42.88,7.43 42.82,7.37 42.82,6.79 IC2.6 | IC2.2 37.68,7.56 37.49,7.37 37.49,6.92 IC2.3 | C16.1 47.65,7.37 | C13.1 45.62,7.37 | v25.8,34.29 25.8,34.8 24.19,36.41 R8.2
  Top 0.508: R3.2 R4.2 118.86,22.52 118.77,22.61 | C1.1 117.92,24.22 118.77,23.37 118.77,22.61 | 118.77,22.61 118.77,22.1 v118.78,22.1 | SJ1.3 v37.49,36.83
  Top 0.61: v72.54,36.32 56.03,36.32 55.01,35.31 v55.01,34.54 | v72.54,42.16 C3.1 | X5.15.1 49.93,7.11 v50.19,7.37
  Top 1.27: 37.49,7.37 40.28,7.37 42.82,7.37 45.62,7.37 47.65,7.37 v48.92,7.37 v50.19,7.37 v51.46,7.37
  Bottom 0.305: 35.58,29.34 v32.15,29.34 26.69,29.34 25.8,30.23 v25.8,34.29 | 35.58,29.34 35.71,29.21 | 35.58,29.34 35.84,29.34 35.96,29.46
  Bottom 0.508: v37.49,36.83 38.5,35.81 38.5,32
  Bottom 0.61: v72.54,42.16 v72.54,36.32
  Bottom 1.27: 55.02,19.73 114.62,19.73 116.99,22.1 v118.78,22.1 124.1,22.1 125.37,23.37 v125.37,34.29 | 55.02,19.73 55.01,19.73 55.01,32 | 55.01,32 v55.01,34.54 | 50.19,32 38.5,32 35.96,29.46 v35.96,20.83 | 50.19,32 55.01,32 | v50.19,34.54 50.19,32 | 52.27,16.98 52.27,8.13 51.51,7.37 v48.92,7.37 | 55.02,19.73 52.27,16.98 | 52.27,16.98 52.24,17.02 48.66,17.02 48.66,17.04 v47.92,17.78
+5V
  Top 0.61: J1.1 13.82,36.32 X5.17.1
  Top 1.27: X9.1.1 26.57,3.05 29.19,3.05 31.65,5.5 C12.1 33.46,5.46 IC2.4
  Bottom 1.27: J1.1 10.45,35.05 8.28,35.05 6.75,33.53 6.75,14.05 15.14,5.66 23.95,5.66 X9.1.1
AI1
  Top 0.305: U2.24 19.68,27.91 19.2,27.43 X1.11.1
AI2
  Top 0.305: U2.25 25.02,27.41 X1.8.1
AI3
  Top 0.305: X3.8.1 142.39,27.18 148.74,33.53 148.74,41.31 145.09,44.96 17.42,44.96 16.66,44.2 16.66,38.61 17.42,37.85 24.53,37.85 28.34,34.04 41.55,34.04 41.8,33.79 U2.16
AI4  (via drill 0.35)
  Top 0.305: X3.11.1 146.2,30.23 149.25,33.27 149.25,41.46 145.25,45.47 17.17,45.47 16.15,44.45 v16.15,36.07 | U2.17 39.35,31.41 38.71,32.05 23.57,32.05 v23.26,31.75
  Bottom 0.305: v23.26,31.75 16.66,31.75 16.15,32.26 v16.15,36.07
AO1
  Top 0.305: X2.11.1 19.2,43.94 19.71,44.45 68.48,44.45 69.24,43.69 69.24,39.12 69.75,38.61 72.87,38.61 IC1.4
AO2
  Top 0.305: X2.8.1 23.01,43.43 23.52,43.94 68.22,43.94 68.73,43.43 68.73,38.61 69.24,38.1 72.86,38.1 IC1.5
AO3
  Top 0.305: X4.8.1 142.39,42.42 140.87,43.94 70.76,43.94 70.25,43.43 70.25,40.13 70.77,39.62 IC1.2
AO4
  Top 0.305: X4.11.1 143.66,44.45 70.51,44.45 69.75,43.69 69.75,39.62 70.25,39.12 IC1.3
BOOT0
  Top 0.305: U2.60 56.84,29.41 61.11,33.68 75.12,33.68 | R2.2 75.12,33.68 | BOOT0.2 84.48,34.29 83.87,33.68 75.12,33.68
DAC_DIN
  Top 0.305: U2.61 56.48,29.91 60.86,34.29 72.54,34.29 75.64,37.39 75.64,38.66 76.1,39.12 IC1.8
DAC_SCLK
  Top 0.305: U2.26 44.84,26.91 55.52,37.59 73.81,37.59 74.32,38.1 74.32,39.37 75.06,40.12 IC1.10
DAC_SYNC
  Top 0.254: IC1.9
  Top 0.305: U2.27 45.11,26.41 55.78,37.08 74.32,37.08 74.98,37.74 74.98,39.01 75.59,39.62 IC1.9
DEBUG_LED  (via drill 0.35)
  Top 0.305: v53.24,30.6 56.52,30.6 61.02,35.1 R10.2 R5.2 | U2.28 38.75,25.91 38.5,26.16 v38.5,26.67
  Bottom 0.305: v53.24,30.6 51.85,29.21 41.04,29.21 v38.5,26.67
DI1  (via drill 0.35)
  Top 0.305: X1.6.1 27.07,26.92 37.11,26.92 v37.36,26.68 | v49.68,29.97 50.12,30.41 U2.62
  Bottom 0.305: v37.36,26.68 40.65,29.97 v49.68,29.97
DI2
  Top 0.305: U2.29 33.68,25.41 32.39,24.13 29.36,24.13 X1.4.1
DI3
  Top 0.305: U2.34 42.3,19.8 41.81,19.3 29.87,19.3 29.36,19.81 X1.3.1
DI4
  Top 0.305: X1.1.1 31.9,20.32 32.41,19.81 41.55,19.81 41.81,20.07 U2.33
DI5
  Top 0.305: X5.1.1 58.62,22.91 48.12,22.91 47.8,22.59 U2.45
DI6
  Top 0.305: X5.3.1 62.38,26.67 60.6,26.67 57.3,23.37 47.65,23.37 47.3,23.02 U2.44
DI7
  Top 0.305: X5.4.1 63.65,24.13 61.54,24.13 59.59,22.17 53.31,22.17 47.65,16.51 46.12,16.51 45.8,16.84 U2.41
DI8
  Top 0.305: X5.6.1 66.32,21.72 53.62,21.72 47.9,16 45.68,16 45.3,16.38 U2.40
DI9
  Top 0.305: X5.8.1 68.4,21.26 53.92,21.26 48.17,15.51 45.27,15.51 44.8,15.98 U2.39
DI10
  Top 0.305: X5.9.1 71.27,21.34 70.71,20.78 54.2,20.78 48.41,14.99 44.9,14.99 44.3,15.58 U2.38
DI11
  Top 0.305: X5.11.1 73.81,20.83 73.3,20.32 54.51,20.32 48.66,14.48 44.5,14.48 43.8,15.18 U2.37
DI12
  Top 0.305: U1.8 116.34,26.87 116.34,22.17 112.97,18.8 94.89,18.8 93.37,20.32 91.59,20.32 X7.11.1
DI13
  Top 0.305: U1.7 115.82,26.95 115.82,22.55 112.58,19.3 95.15,19.3 X7.9.1
DI14
  Top 0.305: U1.6 115.17,26.95 115.17,22.8 112.19,19.81 95.4,19.81 92.86,22.35 X7.8.1
DI15
  Top 0.305: U1.5 114.52,26.95 114.52,23.05 111.8,20.32 97.43,20.32 95.4,22.35 X7.6.1
DI16
  Top 0.305: U1.4 113.85,23.27 111.4,20.83 99.46,20.83 97.94,22.35 X7.4.1
DI17
  Top 0.305: U1.3 113.2,23.51 111.02,21.34 100.73,21.34 X7.3.1
DI18
  Top 0.305: U1.2 112.55,23.75 111.66,22.86 X7.1.1
DI19
  Top 0.305: X3.1.1 133.5,28.7 132.48,29.72 62.89,29.72 58.08,24.91 U2.51
DI20
  Top 0.305: X3.3.1 136.04,27.18 132.99,30.23 62.63,30.23 57.82,25.41 U2.52
DI21
  Top 0.305: U2.36 43.3,14.78 44.06,14.02 48.97,14.02 54.76,19.81 93.11,19.81 106.19,6.73 136.93,6.73 138.33,8.13 138.33,21.84 X3.4.1
DI22
  Top 0.305: U2.35 42.8,14.38 43.67,13.51 49.22,13.51 55.01,19.3 92.86,19.3 106.07,6.1 137.31,6.1 138.96,7.75 138.96,21.97 X3.6.1
DI23  (via drill 0.35)
  Top 0.305: U2.42 46.3,22.68 45.11,23.88 v44.85,23.88 | v36.22,17.78 35.96,18.03 16.91,18.03 11.83,23.11 6.5,23.11 5.74,22.35 5.74,18.75 J2.7
  Bottom 0.305: v44.85,23.88 42.31,23.88 v36.22,17.78 33.42,14.99 X10.1.1
DI24  (via drill 0.35)
  Top 0.305: U1.9 117.1,25.33 v117.07,25.3 | v123.85,25.4 130.71,25.4 131.98,24.13 140.36,24.13 141.12,23.37 141.12,15.75 142.14,14.73 X11.1.1
  Bottom 0.305: v117.07,25.3 123.75,25.3 v123.85,25.4
DO1
  Top 0.305: U2.15 42.3,34.3 42.06,34.54 28.6,34.54 25.55,37.59 X2.6.1
DO2
  Top 0.305: U2.14 42.8,34.57 42.31,35.05 28.85,35.05 28.09,35.81 X2.4.1
DO3
  Top 0.305: X2.3.1 30.63,40.64 40.79,40.64 44.8,36.63 U2.10
DO4
  Top 0.305: X2.1.1 32.15,39.62 41.04,39.62 44.3,36.37 U2.11
DO5
  Top 0.305: U2.9 45.3,36.89 43.33,38.86 X6.1.1
DO6
  Top 0.305: U2.8 45.8,41.84 X6.3.1
DO7
  Top 0.305: U2.6 46.8,39.03 X6.4.1
DO8
  Top 0.305: U2.5 47.3,37.24 49.43,39.37 X6.6.1
DO9
  Top 0.305: U2.4 47.8,36.73 48.28,37.21 49.17,38.1 50.95,38.1 X6.8.1
DO10
  Top 0.305: X6.9.1 53.49,38.35 52.73,37.59 49.54,37.59 48.3,36.35 U2.3
DO11
  Top 0.305: U2.2 48.8,35.95 49.93,37.08 54.04,37.08 56.03,39.08 X6.11.1
DO12
  Top 0.305: U1.23 112.55,36.45 110.89,38.1 109.37,38.1 X8.11.1
DO13
  Top 0.305: U1.22 113.2,36.81 X8.9.1
DO14
  Top 0.305: U1.21 113.85,36.92 111.91,38.86 X8.8.1
DO15
  Top 0.305: U1.20 114.5,41.86 X8.6.1
DO16
  Top 0.305: U1.19 115.15,37.02 116.99,38.86 X8.4.1
DO17
  Top 0.305: U1.18 115.8,36.91 X8.3.1
DO18
  Top 0.305: U1.17 116.45,36.8 117.75,38.1 119.53,38.1 X8.1.1
DO19
  Top 0.305: X4.1.1 133.5,33.27 132.48,32.26 61.85,32.26 57.51,27.91 U2.57
DO20
  Top 0.305: X4.3.1 136,41.87 136,34.88 132.88,31.75 61.99,31.75 57.65,27.41 U2.56
DO21
  Top 0.305: X4.4.1 137.35,39.33 137.35,35.32 133.27,31.24 62.13,31.24 57.3,26.41 U2.54
DO22
  Top 0.305: X4.6.1 139.85,36.83 133.75,30.73 62.38,30.73 57.56,25.91 U2.53
DO23  (via drill 0.35)
  Top 0.305: U2.43 46.8,23.2 v46.12,23.88 | v38,18.54 20.72,18.54 | 20.72,18.54 17.42,18.54 12.09,23.88 5.23,23.88 4.47,23.11 4.47,19.05 4.47,18.75 J2.9 | 20.72,18.54 v20.72,19.3
  Bottom 0.305: v46.12,23.88 45.36,23.11 42.57,23.11 v38,18.54 | v20.72,19.3 X10.2.1
DO24  (via drill 0.35)
  Top 0.305: U1.24 111.88,33.96 111.88,33.11 112.27,32.72 126.59,32.72 v126.9,33.02
  Bottom 0.305: v126.9,33.02 126.64,32.77 126.64,23.37 132.99,17.02 146.2,17.02 X11.2.1
GND  (via drill 0.35)
  Top 0.2: 29.69,7.29 29.61,7.37
  Top 0.254: U1.1 111.9,25.14 v111.4,24.64
  Top 0.305: J2.3 J2.5 7.08,20.4 8.02,21.34 v8.79,21.34 | IC1.6 77.37,38.03 v77.37,36.83 | C4.2 77.53,37 v77.37,36.83 | C1.2 113.69,18.45 v113.69,18.29 | U2.12 43.8,35.34 41.46,37.68 C10.2 C2.2 v38.76,38.86 | U2.31 39.77,24.38 36.89,24.38 C5.2 35.11,22.61 34.19,22.61 33.93,22.35 33.93,22.01 | v34.19,20.83 C20.2 33.93,22.01 | U2.47 48.8,21.05 C7.2 47.05,18.33 v46.51,17.78 | C9.2 52.05,35.14 v51.46,34.54 | v56.81,32 55.99,32 C15.2 C8.2 52.95,31.79 52.07,30.91 U2.63 | U2.18 35.87,30.91 C6.2 35.62,30.99 33.59,30.99 | 33.59,30.99 v32.15,30.99 | v66.95,35.31 LED1.C | R2.1 77.37,35.34 v77.37,36.83 | C16.2 47.65,9.78 | 33.93,22.01 33.08,22.01 32.66,21.59 v32.66,20.83 | C11.2 33.59,30.99 | U1.13 120.5,33.98 v120.55,34.04 | VD1.3 v17.17,34.29 | VD2.3 v17.17,29.72 | R5.1 57.47,34.12 v57.55,34.04 | R6.2 28.43,31.08 v28.47,31.11
  Top 0.61: C3.2 v77.62,42.16
  Top 0.813: C13.2 46.63,9.49 | 46.63,9.49 C16.2 | 46.63,9.49 v46.63,10.92 v46.63,11.94 | C12.2 33.42,9.27
  Top 1.016: J1.6 9.21,27.65 v10.19,26.67 | v10.19,26.67 10.31,26.67 | v10.19,26.67 v11.33,26.67 v12.34,26.67
  Top 1.27: X9.2.1 29.61,7.37 31.52,9.27 33.42,9.27 IC2.1
  Bottom 0.813: v46.63,10.92 v46.63,11.94
  Bottom 1.016: 10.56,26.67 v10.19,26.67
  pour Bottom (isolate 0.254, no thermals): 0.15,44.96 0.15,12.95 2.94,10.16 4.98,10.16 7.52,7.62 7.52,1.52 8.02,1.02 52.73,1.02 52.73,16.76 55.27,19.3 91.34,19.3 94.64,16 94.64,0.76 95.15,0.25 160.42,0.25 162.46,2.29 162.46,43.94 159.41,46.99 2.18,46.99
I2C_SCL  (via drill 0.35)
  Top 0.305: R4.1 118.4,25.86 U1.11 118.4,28.17 117.82,28.75 97.99,28.75 v97.43,28.19 | U2.58 57.27,28.41 61.62,32.77 96.42,32.77 v97.43,33.78
  Bottom 0.305: v97.43,33.78 v97.43,28.19
I2C_SDA  (via drill 0.35)
  Top 0.305: R3.1 119.57,26.98 U1.12 119.05,28.17 118.01,29.21 97.18,29.21 v96.16,28.19 | U2.59 57.12,28.91 61.43,33.22 95.6,33.22 v96.16,33.78
  Bottom 0.305: v96.16,33.78 v96.16,28.19
JTAG_JTDI  (via drill 0.35)
  Top 0.305: U2.50 50.41,24.41 v49.43,25.4 | v33.17,15.75 32.92,15.75 32.36,16.31 6.55,16.31 5.81,15.57 J2.8
  Bottom 0.305: v49.43,25.4 42.82,25.4 v33.17,15.75
JTAG_JTDO  (via drill 0.35)
  Top 0.305: U2.55 v49.44,26.91 v49.43,26.92 | J2.6 7.08,13.54 7.01,13.46 8.79,11.68 32.1,11.68 v33.14,12.72
  Bottom 0.305: v49.43,26.92 50.19,26.16 50.19,23.11 48.41,21.34 42.82,21.34 34.21,12.72 v33.14,12.72
JTAG_NRST  (via drill 0.35)
  Top 0.305: U2.7 46.3,29.77 v44.22,27.69 | v33.17,16.76 33.04,16.89 5.61,16.89 4.47,15.75 4.47,15.49 4.54,15.42 J2.10
  Bottom 0.305: v44.22,27.69 33.3,16.76 v33.17,16.76
JTAG_SWCLK  (via drill 0.35)
  Top 0.305: U2.49 49.43,23.91 v49.43,24.13 | v33.17,13.72 31.9,12.45 9.29,12.45 8.28,13.46 8.35,13.54 J2.4 | J2.4 8.35,14.15 8.53,13.97 8.53,14.43 J2.4
  Bottom 0.305: v49.43,24.13 49.43,23.37 48.16,22.1 42.57,22.1 34.19,13.72 v33.17,13.72
JTAG_SWDIO  (via drill 0.35)
  Top 0.305: v32.15,13.72 9.62,13.72 J2.2 | v46.63,20.57 47.64,20.57 48.3,21.23 U2.46
  Bottom 0.305: v46.63,20.57 43.08,20.57 34.19,11.68 32.92,11.68 32.15,12.45 v32.15,13.72
N$1
  Top 0.305: U1.14 118.4,35.45 118.86,35.9 R1.1
N$2
  Top 0.305: U2.30 39.78,24.89 35.2,24.89 34.19,23.88 C20.1
N$5
  Top 0.305: LED1.A R10.1
POTI1  (via drill 0.35)
  Top 0.305: X5.13.1 76.35,28.45 76.86,28.96 v80.16,28.96
  Bottom 0.305: v80.16,28.96 80.16,43.69 79.52,44.33 59.22,44.33 58.57,43.69 X6.13.1
POTI2  (via drill 0.35)
  Top 0.305: v86.51,34.04 86.51,38.35 87.53,39.37 X8.13.1
  Bottom 0.305: X7.13.1 v86.51,34.04
RJ12_CLK
  Top 0.305: U2.21 40.59,29.41 40.97,29.8 40.97,31.45 39.9,32.51 22.65,32.51 VD2.2 | J1.4 12.31,30.19 12.85,30.73 20.74,30.73 VD2.2 | R7.1 24.63,30.67 VD2.2
RJ12_CS
  Top 0.305: U2.20 38.7,29.91 37.23,28.45 27.07,28.45 | 27.07,28.45 20.98,28.45 | 20.98,28.45 11.97,28.45 J1.5 | VD2.1 20.98,28.6 20.98,28.45 | R6.1 27.07,28.45
RJ12_MISO
  Top 0.305: J1.3 12.52,31.46 14.08,33.02 20.72,33.02 | U2.22 40.73,28.91 41.55,29.73 41.55,31.62 40.16,33.02 20.72,33.02 | 20.72,33.02 20.81,33.1 VD1.1
RJ12_MOSI
  Top 0.305: U2.23 41.01,28.41 42.19,29.59 42.19,31.75 40.41,33.53 24.03,33.53 | J1.2 13.02,32.73 15.53,35.24 VD1.2 21.04,35.24 22.76,33.53 24.03,33.53 | R8.1 24.03,33.53
V+  (via drill 0.35)
  Top 0.305: IC1.7 79.65,38.62 | 79.65,38.62 81.17,38.62 v81.18,38.61 | C4.1 79.65,38.62 | 32.66,36.58 SJ1.1
  Top 0.508: v29.87,36.58 32.66,36.58
  Top 0.61: X7.12.1 86.51,24.13 81.18,24.13 | X5.12.1 76.35,24.13 81.18,24.13 | 81.18,24.13 v81.18,28.96
  Top 1.27: v14.94,45.27 14.94,42.23 5.99,33.27 5.99,27.43 8.28,25.15 15.64,25.15 | 15.64,25.15 17.68,25.15 X1.12.1 | 15.64,25.15 15.64,22.86 17.68,20.83 19.96,20.83 21.74,22.61 X1.9.1
  Bottom 0.305: 17.93,44.96 17.62,45.27 v14.94,45.27 | 81.18,45.02 80.92,45.27 | 147.47,44.77 147.47,45.27
  Bottom 0.508: 21.74,45.27 X2.9.1 21.74,37.08 22.25,36.58 v29.87,36.58 | X2.12.1 17.93,44.96
  Bottom 0.61: X6.12.1 57.3,45.27 | X8.12.1 106.83,45.27 | X4.9.1 143.66,45.27 | X4.12.1 147.47,44.77 | v81.18,28.96 v81.18,38.61 81.18,45.02
  Bottom 1.27: v14.94,45.27 21.74,45.27 57.3,45.27 80.92,45.27 106.83,45.27 143.66,45.27 147.47,45.27 149.44,45.27 150.77,43.94 150.77,28.19 | 150.77,28.19 150.77,24.13 149.5,22.86 X3.12.1 | X3.9.1 143.66,27.43 144.42,28.19 150.77,28.19
VDDA
  Top 0.305: SJ1.2 34.44,36.45 35.33,35.56 38.34,35.56 C2.1 39.14,35.6 40.92,35.6 C10.1 41.68,35.6 42.78,35.6 43.3,35.08 U2.13
(copper drawn outside any net)
  shapes: Top area x1

### Text on the board
tNames: X2 | X6 | X8 | X4 | 2 | 2 | 1 | 1 | 1 | 2 | 1 | 2 | 2 | 1 | 2 | 1 | 1 | 2 | 1 | 2 | X7 | X3 | X1 | X5 | JTAG | 2 | 1 | 1 | 2 | X10 | X11 | X9 | 4D-Joystick / Remote-Unit / REV 00 | 5V | GND